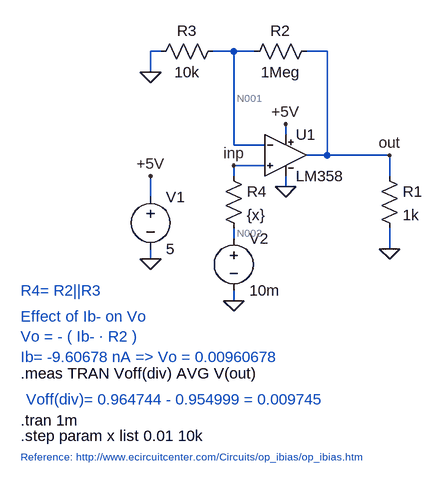
[diagram p0: schematic 02-LM358 bias current effect - non-inv amp.asc]
02-LM358 bias current effect - non-inv amp.asc, the LTspice schematic file:
Version 4
SHEET 1 880 688
WIRE 48 48 32 48
WIRE 160 48 128 48
WIRE 192 48 160 48
WIRE 304 48 272 48
WIRE 32 80 32 48
WIRE 240 176 240 160
WIRE 160 192 160 48
WIRE 208 192 160 192
WIRE 304 208 304 48
WIRE 304 208 272 208
WIRE 400 208 304 208
WIRE 208 224 160 224
WIRE 160 240 160 224
WIRE 400 240 400 208
WIRE 240 256 240 240
WIRE 32 272 32 240
WIRE 160 336 160 320
WIRE 400 352 400 320
WIRE 32 368 32 352
WIRE 160 432 160 416
FLAG 32 240 +5V
FLAG 240 160 +5V
FLAG 160 432 0
FLAG 400 352 0
FLAG 400 208 out
FLAG 160 224 inp
FLAG 32 80 0
FLAG 32 368 0
FLAG 240 256 0
SYMBOL voltage 32 256 R0
WINDOW 123 0 0 Left 0
WINDOW 39 0 0 Left 0
SYMATTR InstName V1
SYMATTR Value 5
SYMBOL voltage 160 320 R0
WINDOW 123 0 0 Left 0
WINDOW 39 0 0 Left 0
SYMATTR InstName V2
SYMATTR Value 10m
SYMBOL res 384 224 R0
SYMATTR InstName R1
SYMATTR Value 1k
SYMBOL res 288 32 R90
WINDOW 0 0 56 VBottom 2
WINDOW 3 32 56 VTop 2
SYMATTR InstName R2
SYMATTR Value 1Meg
SYMBOL res 144 32 R90
WINDOW 0 0 56 VBottom 2
WINDOW 3 32 56 VTop 2
SYMATTR InstName R3
SYMATTR Value 10k
SYMBOL LM358_onsemi 208 192 R0
SYMATTR InstName U1
SYMBOL res 144 224 R0
SYMATTR InstName R4
SYMATTR Value {x}
TEXT -168 616 Left 2 !.tran 1m
TEXT -168 416 Left 2 ;R4= R2||R3
TEXT -168 640 Left 2 !.step param x list 0.01 10k
TEXT -168 456 Left 2 ;Effect of Ib- on Vo\nVo = - ( Ib- ∙ R2 )\nIb= -9.60678 nA => Vo = 0.00960678
TEXT -168 544 Left 2 !.meas TRAN Voff(div) AVG V(out)
TEXT -160 584 Left 2 ;Voff(div)= 0.964744 - 0.954999 = 0.009745
TEXT -168 672 Left 1 ;Reference: http://www.ecircuitcenter.com/Circuits/op_ibias/op_ibias.htm

The netlist it stands for:
* 02-LM358 bias current effect - non-inv amp.asc
V1 +5V 0 5
V2 N002 0 10m
R1 out 0 1k
R2 out N001 1Meg
R3 N001 0 10k
XU1 inp N001 +5V 0 out LM358  ; pins In+ In- V+ V- OUT
R4 inp N002 {x}
.tran 1m
* R4= R2||R3
.step param x list 0.01 10k
* Effect of Ib- on Vo
* Vo = - ( Ib- ∙ R2 )
* Ib= -9.60678 nA => Vo = 0.00960678
.meas TRAN Voff(div) AVG V(out)
* Voff(div)= 0.964744 - 0.954999 = 0.009745
* Reference: http://www.ecircuitcenter.com/Circuits/op_ibias/op_ibias.htm
.lib C:\Users\LP\Documents\GitHub\LTspice\02-offset voltage - bias & offset current\02-LM358\LM358 Onsemi.MOD
.backanno
.end

* Results of the author's LTspice run, read from the files saved beside the schematic
* Operating Point (first step), zero values left out:
*   x = 10 m
*   V(+5v) = 5 V
*   V(n002) = 10 mV
*   V(out) = 955 mV
*   V(n001) = 9.557 mV
*   V(inp) = 10 mV
*   I(R4) = 9.654 nA
*   I(R3) = 955.7 nA
*   I(R2) = 945.4 nA
*   I(R1) = 955 µA
*   I(V2) = 9.654 nA
*   I(V1) = -1.161 mA
*   Ix(u1:1) = -9.654 nA
*   Ix(u1:2) = -10.25 nA
*   Ix(u1:3) = 1.161 mA
*   Ix(u1:4) = -205.2 µA
*   Ix(u1:5) = -955.9 µA
* From the log:
*   Measurement: voff(div)
*     step  AVG(v(out))  FROM  TO
*        1  0.954999  0  0.001
*        2  0.964744  0  0.001